# EAGLE schematic stereo_mix_back_digital (EAGLE 9.6.2)

## Sheet 1 of 5: Channels
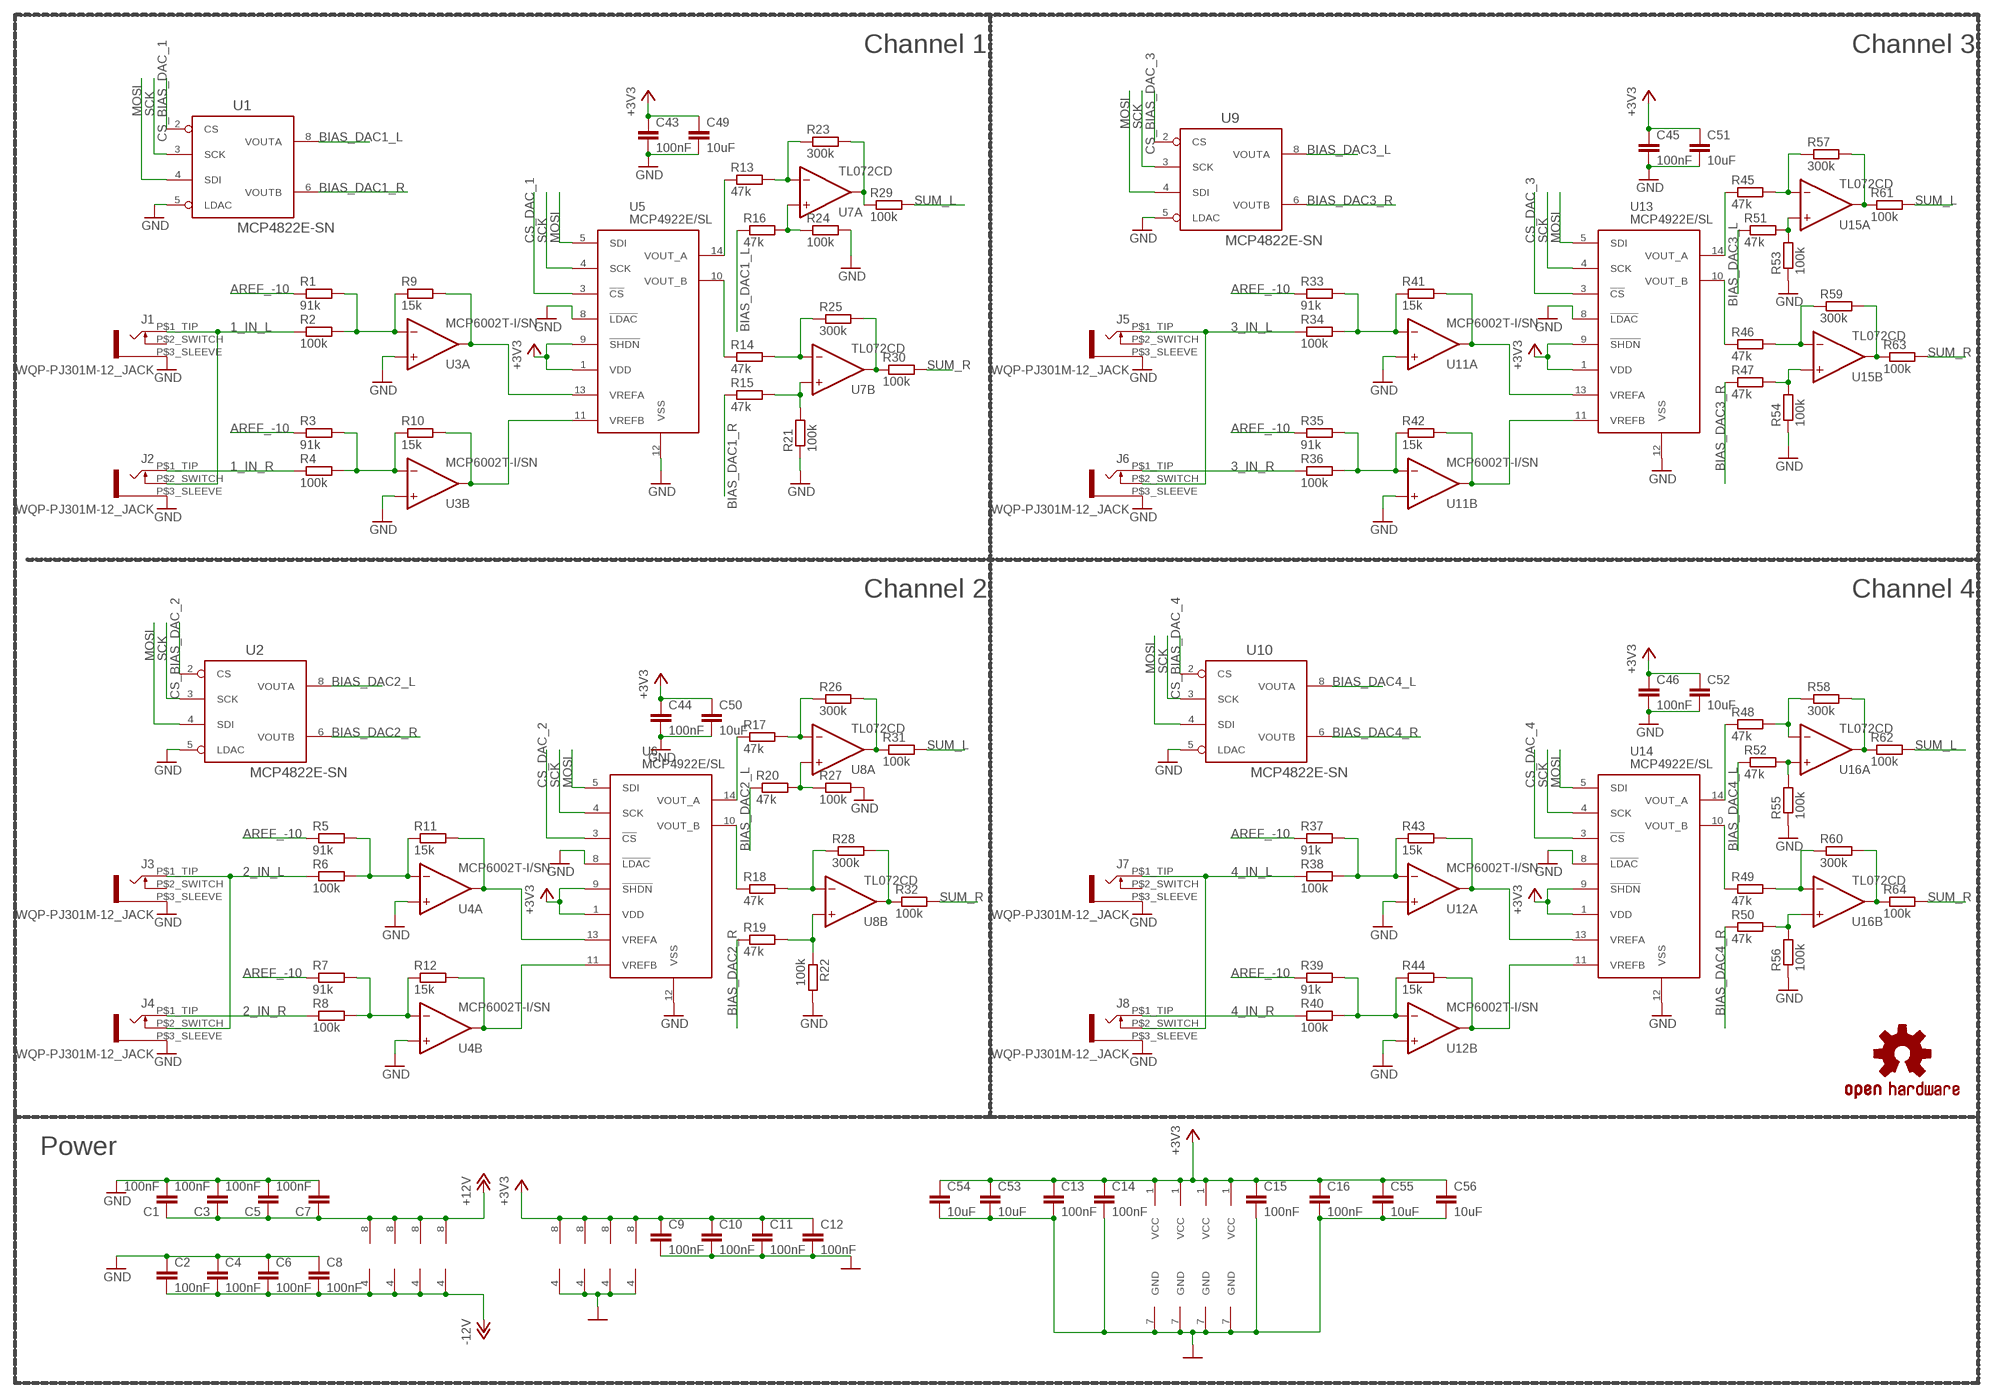
[diagram p0: schematic, sheet 1]

### Parts
C1  100nF  C-EUC0402  [C0402]
C2  100nF  C-EUC0402  [C0402]
C3  100nF  C-EUC0402  [C0402]
C4  100nF  C-EUC0402  [C0402]
C5  100nF  C-EUC0402  [C0402]
C6  100nF  C-EUC0402  [C0402]
C7  100nF  C-EUC0402  [C0402]
C8  100nF  C-EUC0402  [C0402]
C9  100nF  C-EUC0402  [C0402]
C10  100nF  C-EUC0402  [C0402]
C11  100nF  C-EUC0402  [C0402]
C12  100nF  C-EUC0402  [C0402]
C13  100nF  C-EUC0402  [C0402]
C14  100nF  C-EUC0402  [C0402]
C15  100nF  C-EUC0402  [C0402]
C16  100nF  C-EUC0402  [C0402]
C43  100nF  C-EUC0402  [C0402]
C44  100nF  C-EUC0402  [C0402]
C45  100nF  C-EUC0402  [C0402]
C46  100nF  C-EUC0402  [C0402]
C49  10uF  C-EUC0805  [C0805]
C50  10uF  C-EUC0805  [C0805]
C51  10uF  C-EUC0805  [C0805]
C52  10uF  C-EUC0805  [C0805]
C53  10uF  C-EUC0805  [C0805]
C54  10uF  C-EUC0805  [C0805]
C55  10uF  C-EUC0805  [C0805]
C56  10uF  C-EUC0805  [C0805]
J1  WQP-PJ301M-12_JACK  [WQP-PJ301M-12_JACK]
J2  WQP-PJ301M-12_JACK  [WQP-PJ301M-12_JACK]
J3  WQP-PJ301M-12_JACK  [WQP-PJ301M-12_JACK]
J4  WQP-PJ301M-12_JACK  [WQP-PJ301M-12_JACK]
J5  WQP-PJ301M-12_JACK  [WQP-PJ301M-12_JACK]
J6  WQP-PJ301M-12_JACK  [WQP-PJ301M-12_JACK]
J7  WQP-PJ301M-12_JACK  [WQP-PJ301M-12_JACK]
J8  WQP-PJ301M-12_JACK  [WQP-PJ301M-12_JACK]
LOGO1  OSHW-LOGOS  [OSHW-LOGO-S]
R1  91k  R-EU_R0402  [R0402]
R2  100k  R-EU_R0402  [R0402]
R3  91k  R-EU_R0402  [R0402]
R4  100k  R-EU_R0402  [R0402]
R5  91k  R-EU_R0402  [R0402]
R6  100k  R-EU_R0402  [R0402]
R7  91k  R-EU_R0402  [R0402]
R8  100k  R-EU_R0402  [R0402]
R9  15k  R-EU_R0402  [R0402]
R10  15k  R-EU_R0402  [R0402]
R11  15k  R-EU_R0402  [R0402]
R12  15k  R-EU_R0402  [R0402]
R13  47k  R-EU_R0402  [R0402]
R14  47k  R-EU_R0402  [R0402]
R15  47k  R-EU_R0402  [R0402]
R16  47k  R-EU_R0402  [R0402]
R17  47k  R-EU_R0402  [R0402]
R18  47k  R-EU_R0402  [R0402]
R19  47k  R-EU_R0402  [R0402]
R20  47k  R-EU_R0402  [R0402]
R21  100k  R-EU_R0402  [R0402]
R22  100k  R-EU_R0402  [R0402]
R23  300k  R-EU_R0402  [R0402]
R24  100k  R-EU_R0402  [R0402]
R25  300k  R-EU_R0402  [R0402]
R26  300k  R-EU_R0402  [R0402]
R27  100k  R-EU_R0402  [R0402]
R28  300k  R-EU_R0402  [R0402]
R29  100k  R-EU_R0402  [R0402]
R30  100k  R-EU_R0402  [R0402]
R31  100k  R-EU_R0402  [R0402]
R32  100k  R-EU_R0402  [R0402]
R33  91k  R-EU_R0402  [R0402]
R34  100k  R-EU_R0402  [R0402]
R35  91k  R-EU_R0402  [R0402]
R36  100k  R-EU_R0402  [R0402]
R37  91k  R-EU_R0402  [R0402]
R38  100k  R-EU_R0402  [R0402]
R39  91k  R-EU_R0402  [R0402]
R40  100k  R-EU_R0402  [R0402]
R41  15k  R-EU_R0402  [R0402]
R42  15k  R-EU_R0402  [R0402]
R43  15k  R-EU_R0402  [R0402]
R44  15k  R-EU_R0402  [R0402]
R45  47k  R-EU_R0402  [R0402]
R46  47k  R-EU_R0402  [R0402]
R47  47k  R-EU_R0402  [R0402]
R48  47k  R-EU_R0402  [R0402]
R49  47k  R-EU_R0402  [R0402]
R50  47k  R-EU_R0402  [R0402]
R51  47k  R-EU_R0402  [R0402]
R52  47k  R-EU_R0402  [R0402]
R53  100k  R-EU_R0402  [R0402]
R54  100k  R-EU_R0402  [R0402]
R55  100k  R-EU_R0402  [R0402]
R56  100k  R-EU_R0402  [R0402]
R57  300k  R-EU_R0402  [R0402]
R58  300k  R-EU_R0402  [R0402]
R59  300k  R-EU_R0402  [R0402]
R60  300k  R-EU_R0402  [R0402]
R61  100k  R-EU_R0402  [R0402]
R62  100k  R-EU_R0402  [R0402]
R63  100k  R-EU_R0402  [R0402]
R64  100k  R-EU_R0402  [R0402]
U1  MCP4822E-SN  [SOIC8]
U2  MCP4822E-SN  [SOIC8]
U3  MCP6002T-I/SN  [SOIC8]
U4  MCP6002T-I/SN  [SOIC8]
U5  MCP4922E/SL  [SO-14]
U6  MCP4922E/SL  [SO-14]
U7  TL072CD  [SOIC8]
U8  TL072CD  [SOIC8]
U9  MCP4822E-SN  [SOIC8]
U10  MCP4822E-SN  [SOIC8]
U11  MCP6002T-I/SN  [SOIC8]
U12  MCP6002T-I/SN  [SOIC8]
U13  MCP4922E/SL  [SO-14]
U14  MCP4922E/SL  [SO-14]
U15  TL072CD  [SOIC8]
U16  TL072CD  [SOIC8]

### Nets
1_IN_L: J1.P$1_TIP J2.P$2_SWITCH R2.1
1_IN_R: J2.P$1_TIP R4.1
2_IN_L: J3.P$1_TIP J4.P$2_SWITCH R6.1
2_IN_R: J4.P$1_TIP R8.1
3_IN_L: J5.P$1_TIP J6.P$2_SWITCH R34.1
3_IN_R: J6.P$1_TIP R36.1
4_IN_L: J7.P$1_TIP J8.P$2_SWITCH R38.1
4_IN_R: J8.P$1_TIP R40.1
+3V3 [power]: C9.1 C10.1 C11.1 C12.1 C13.1 C14.1 C15.1 C16.1 C43.1 C44.1 C45.1 C46.1 C49.1 C50.1 C51.1 C52.1 C53.1 C54.1 C55.1 C56.1 U1.1(VCC) U2.1(VCC) U3.8(P:V+) U4.8(P:V+) U5.1(VDD) U5.9(!SHDN) U6.1(VDD) U6.9(!SHDN) U9.1(VCC) U10.1(VCC) U11.8(P:V+) U12.8(P:V+) U13.1(VDD) U13.9(!SHDN) U14.1(VDD) U14.9(!SHDN) ; also sheet 2,3,5
+12V [power]: C1.1 C3.1 C5.1 C7.1 U7.8(P:V+) U8.8(P:V+) U15.8(P:V+) U16.8(P:V+) ; also sheet 4,5
-12V [power]: C2.2 C4.2 C6.2 C8.2 U7.4(P:V-) U8.4(P:V-) U15.4(P:V-) U16.4(P:V-) ; also sheet 4,5
AREF_-10 [power]: R1.1 R3.1 R5.1 R7.1 R33.1 R35.1 R37.1 R39.1 ; also sheet 2,5
BIAS_DAC1_L: R16.1 U1.8(VOUTA)
BIAS_DAC1_R: R15.1 U1.6(VOUTB)
BIAS_DAC2_L: R20.1 U2.8(VOUTA)
BIAS_DAC2_R: R19.1 U2.6(VOUTB)
BIAS_DAC3_L: R51.1 U9.8(VOUTA)
BIAS_DAC3_R: R47.1 U9.6(VOUTB)
BIAS_DAC4_L: R52.1 U10.8(VOUTA)
BIAS_DAC4_R: R50.1 U10.6(VOUTB)
CS_BIAS_DAC_1: U1.2(CS) ; also sheet 3
CS_BIAS_DAC_2: U2.2(CS) ; also sheet 3
CS_BIAS_DAC_3: U9.2(CS) ; also sheet 3
CS_BIAS_DAC_4: U10.2(CS) ; also sheet 3
CS_DAC_1: U5.3(!CS) ; also sheet 3
CS_DAC_2: U6.3(!CS) ; also sheet 3
CS_DAC_3: U13.3(!CS) ; also sheet 3
CS_DAC_4: U14.3(!CS) ; also sheet 3
GND: C1.2 C2.1 C3.2 C4.1 C5.2 C6.1 C7.2 C8.1 C9.2 C10.2 C11.2 C12.2 C13.2 C14.2 C15.2 C16.2 C43.2 C44.2 C45.2 C46.2 C49.2 C50.2 C51.2 C52.2 C53.2 C54.2 C55.2 C56.2 J1.P$3_SLEEVE J2.P$3_SLEEVE J3.P$3_SLEEVE J4.P$3_SLEEVE J5.P$3_SLEEVE J6.P$3_SLEEVE J7.P$3_SLEEVE J8.P$3_SLEEVE R21.1 R22.2 R24.2 R27.2 R53.1 R54.1 R55.1 R56.1 U1.5(LDAC) U1.7(GND) U2.5(LDAC) U2.7(GND) U3.3(A:+IN) U3.4(P:V-) U3.5(B:+IN) U4.3(A:+IN) U4.4(P:V-) U4.5(B:+IN) U5.8(!LDAC) U5.12(VSS) U6.8(!LDAC) U6.12(VSS) U9.5(LDAC) U9.7(GND) U10.5(LDAC) U10.7(GND) U11.3(A:+IN) U11.4(P:V-) U11.5(B:+IN) U12.3(A:+IN) U12.4(P:V-) U12.5(B:+IN) U13.8(!LDAC) U13.12(VSS) U14.8(!LDAC) U14.12(VSS) ; also sheet 2,3,4,5
MOSI: U1.4(SDI) U2.4(SDI) U5.5(SDI) U6.5(SDI) U9.4(SDI) U10.4(SDI) U13.5(SDI) U14.5(SDI) ; also sheet 3
N$1: R13.1 U5.14(VOUT_A)
N$2: R3.2 R4.2 R10.1 U3.6(B:-IN)
N$3: R13.2 R23.1 U7.2(A:-IN)
N$4: R9.2 U3.1(A:OUT) U5.13(VREFA)
N$5: R10.2 U3.7(B:OUT) U5.11(VREFB)
N$6: R1.2 R2.2 R9.1 U3.2(A:-IN)
N$7: R25.2 R30.1 U7.7(B:OUT)
N$8: R23.2 R29.1 U7.1(A:OUT)
N$9: R14.2 R25.1 U7.6(B:-IN)
N$10: R14.1 U5.10(VOUT_B)
N$14: R16.2 R24.1 U7.3(A:+IN)
N$16: R15.2 R21.2 U7.5(B:+IN)
N$19: R7.2 R8.2 R12.1 U4.6(B:-IN)
N$20: R12.2 U4.7(B:OUT) U6.11(VREFB)
N$21: R11.2 U4.1(A:OUT) U6.13(VREFA)
N$22: R5.2 R6.2 R11.1 U4.2(A:-IN)
N$23: R17.1 U6.14(VOUT_A)
N$24: R17.2 R26.1 U8.2(A:-IN)
N$25: R26.2 R31.1 U8.1(A:OUT)
N$26: R18.2 R28.1 U8.6(B:-IN)
N$27: R18.1 U6.10(VOUT_B)
N$28: R28.2 R32.1 U8.7(B:OUT)
N$29: R35.2 R36.2 R42.1 U11.6(B:-IN)
N$30: R42.2 U11.7(B:OUT) U13.11(VREFB)
N$31: R41.2 U11.1(A:OUT) U13.13(VREFA)
N$33: R33.2 R34.2 R41.1 U11.2(A:-IN)
N$34: R45.1 U13.14(VOUT_A)
N$35: R45.2 R57.1 U15.2(A:-IN)
N$36: R57.2 R61.1 U15.1(A:OUT)
N$37: R46.2 R59.1 U15.6(B:-IN)
N$38: R46.1 U13.10(VOUT_B)
N$39: R59.2 R63.1 U15.7(B:OUT)
N$40: R39.2 R40.2 R44.1 U12.6(B:-IN)
N$41: R44.2 U12.7(B:OUT) U14.11(VREFB)
N$44: R43.2 U12.1(A:OUT) U14.13(VREFA)
N$46: R37.2 R38.2 R43.1 U12.2(A:-IN)
N$49: R48.1 U14.14(VOUT_A)
N$50: R48.2 R58.1 U16.2(A:-IN)
N$51: R58.2 R62.1 U16.1(A:OUT)
N$52: R49.2 R60.1 U16.6(B:-IN)
N$53: R49.1 U14.10(VOUT_B)
N$54: R60.2 R64.1 U16.7(B:OUT)
N$67: R20.2 R27.1 U8.3(A:+IN)
N$68: R19.2 R22.1 U8.5(B:+IN)
N$70: R51.2 R53.2 U15.3(A:+IN)
N$71: R47.2 R54.2 U15.5(B:+IN)
N$72: R50.2 R56.2 U16.5(B:+IN)
N$73: R52.2 R55.2 U16.3(A:+IN)
SCK: U1.3(SCK) U2.3(SCK) U5.4(SCK) U6.4(SCK) U9.3(SCK) U10.3(SCK) U13.4(SCK) U14.4(SCK) ; also sheet 3
SUM_L: R29.2 R31.2 R61.2 R62.2 ; also sheet 4
SUM_R: R30.2 R32.2 R63.2 R64.2 ; also sheet 4
Unconnected: J1.P$2_SWITCH J3.P$2_SWITCH J5.P$2_SWITCH J7.P$2_SWITCH

### Notes on the sheet
- Channel 1 | Channel 3
- Channel 2 | Channel 4
- Power

## Sheet 2 of 5: CV Inputs
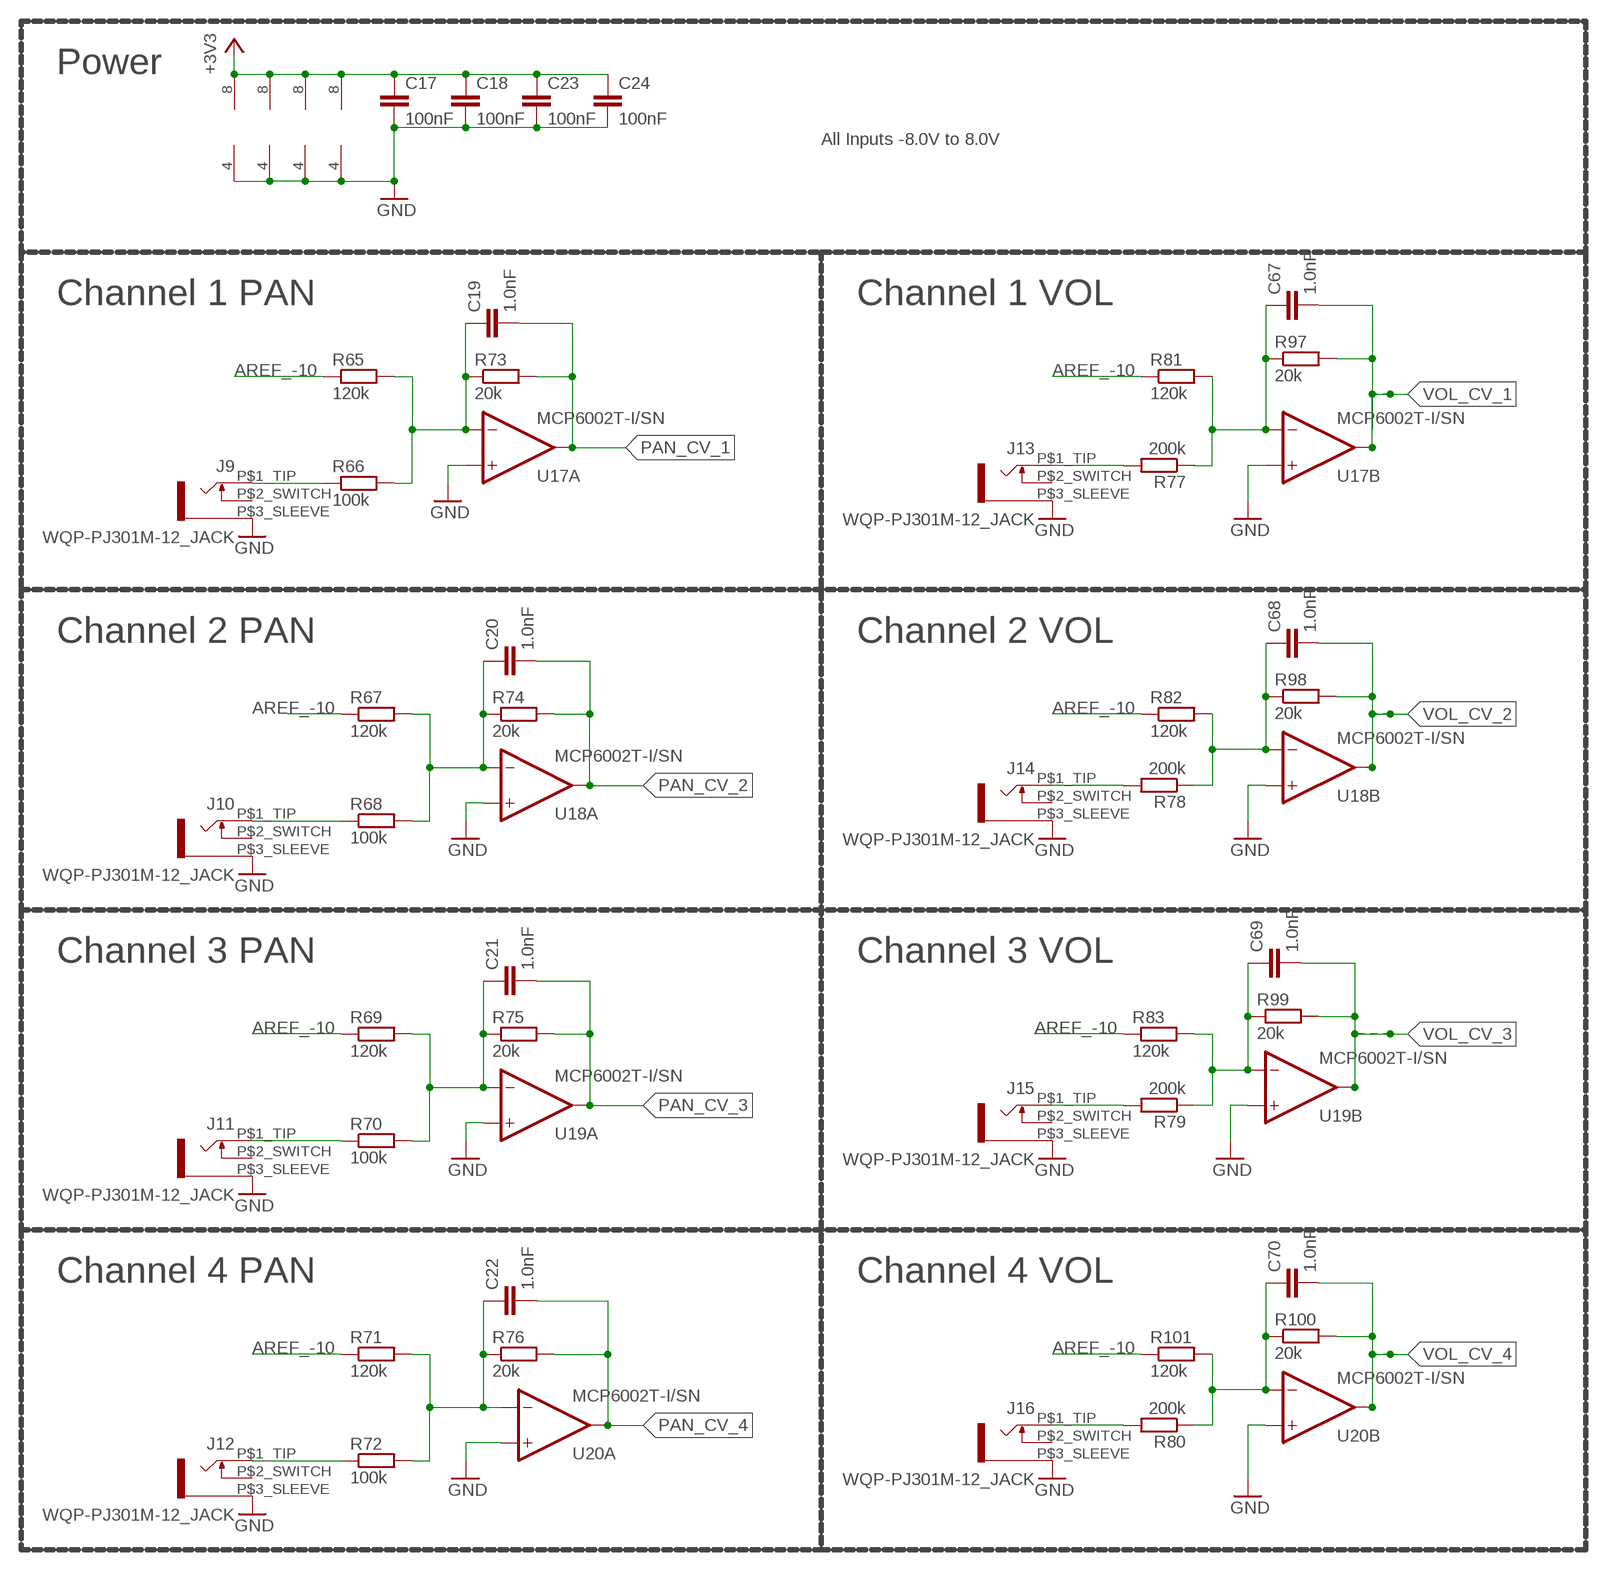
[diagram p1: schematic, sheet 2]

### Parts
C17  100nF  C-EUC0402  [C0402]
C18  100nF  C-EUC0402  [C0402]
C19  1.0nF  C-EUC0402  [C0402]
C20  1.0nF  C-EUC0402  [C0402]
C21  1.0nF  C-EUC0402  [C0402]
C22  1.0nF  C-EUC0402  [C0402]
C23  100nF  C-EUC0402  [C0402]
C24  100nF  C-EUC0402  [C0402]
C67  1.0nF  C-EUC0402  [C0402]
C68  1.0nF  C-EUC0402  [C0402]
C69  1.0nF  C-EUC0402  [C0402]
C70  1.0nF  C-EUC0402  [C0402]
J9  WQP-PJ301M-12_JACK  [WQP-PJ301M-12_JACK]
J10  WQP-PJ301M-12_JACK  [WQP-PJ301M-12_JACK]
J11  WQP-PJ301M-12_JACK  [WQP-PJ301M-12_JACK]
J12  WQP-PJ301M-12_JACK  [WQP-PJ301M-12_JACK]
J13  WQP-PJ301M-12_JACK  [WQP-PJ301M-12_JACK]
J14  WQP-PJ301M-12_JACK  [WQP-PJ301M-12_JACK]
J15  WQP-PJ301M-12_JACK  [WQP-PJ301M-12_JACK]
J16  WQP-PJ301M-12_JACK  [WQP-PJ301M-12_JACK]
R65  120k  R-EU_R0402  [R0402]
R66  100k  R-EU_R0402  [R0402]
R67  120k  R-EU_R0402  [R0402]
R68  100k  R-EU_R0402  [R0402]
R69  120k  R-EU_R0402  [R0402]
R70  100k  R-EU_R0402  [R0402]
R71  120k  R-EU_R0402  [R0402]
R72  100k  R-EU_R0402  [R0402]
R73  20k  R-EU_R0402  [R0402]
R74  20k  R-EU_R0402  [R0402]
R75  20k  R-EU_R0402  [R0402]
R76  20k  R-EU_R0402  [R0402]
R77  200k  R-EU_R0402  [R0402]
R78  200k  R-EU_R0402  [R0402]
R79  200k  R-EU_R0402  [R0402]
R80  200k  R-EU_R0402  [R0402]
R81  120k  R-EU_R0402  [R0402]
R82  120k  R-EU_R0402  [R0402]
R83  120k  R-EU_R0402  [R0402]
R97  20k  R-EU_R0402  [R0402]
R98  20k  R-EU_R0402  [R0402]
R99  20k  R-EU_R0402  [R0402]
R100  20k  R-EU_R0402  [R0402]
R101  120k  R-EU_R0402  [R0402]
U17  MCP6002T-I/SN  [SOIC8]
U18  MCP6002T-I/SN  [SOIC8]
U19  MCP6002T-I/SN  [SOIC8]
U20  MCP6002T-I/SN  [SOIC8]

### Nets
2_PAN_CV_IN: J10.P$1_TIP R68.1
2_VOLUME_CV: J14.P$1_TIP R78.2
3_PAN_CV_IN: J11.P$1_TIP R70.1
3_VOLUME_CV: J15.P$1_TIP R79.2
4_PAN_CV_IN: J12.P$1_TIP R72.1
4_VOLUME_CV: J16.P$1_TIP R80.2
+3V3 [power]: C17.1 C18.1 C23.1 C24.1 U17.8(P:V+) U18.8(P:V+) U19.8(P:V+) U20.8(P:V+) ; also sheet 1,3,5
AREF_-10 [power]: R65.1 R67.1 R69.1 R71.1 R81.1 R82.1 R83.1 R101.1 ; also sheet 1,5
GND: C17.2 C18.2 C23.2 C24.2 J9.P$3_SLEEVE J10.P$3_SLEEVE J11.P$3_SLEEVE J12.P$3_SLEEVE J13.P$3_SLEEVE J14.P$3_SLEEVE J15.P$3_SLEEVE J16.P$3_SLEEVE U17.3(A:+IN) U17.4(P:V-) U17.5(B:+IN) U18.3(A:+IN) U18.4(P:V-) U18.5(B:+IN) U19.3(A:+IN) U19.4(P:V-) U19.5(B:+IN) U20.3(A:+IN) U20.4(P:V-) U20.5(B:+IN) ; also sheet 1,3,4,5
N$15: C69.1 R79.1 R83.2 R99.1 U19.6(B:-IN)
N$17: C70.1 R80.1 R100.1 R101.2 U20.6(B:-IN)
N$32: C19.1 R65.2 R66.2 R73.1 U17.2(A:-IN)
N$62: C22.1 R71.2 R72.2 R76.1 U20.2(A:-IN)
N$63: C21.1 R69.2 R70.2 R75.1 U19.2(A:-IN)
N$64: C20.1 R67.2 R68.2 R74.1 U18.2(A:-IN)
N$65: C67.1 R77.1 R81.2 R97.1 U17.6(B:-IN)
N$74: C68.1 R78.1 R82.2 R98.1 U18.6(B:-IN)
N$84: J9.P$1_TIP R66.1
N$89: J13.P$1_TIP R77.2
PAN_CV_1: C19.2 R73.2 U17.1(A:OUT) ; also sheet 3
PAN_CV_2: C20.2 R74.2 U18.1(A:OUT) ; also sheet 3
PAN_CV_3: C21.2 R75.2 U19.1(A:OUT) ; also sheet 3
PAN_CV_4: C22.2 R76.2 U20.1(A:OUT) ; also sheet 3
VOL_CV_1: C67.2 R97.2 U17.7(B:OUT) ; also sheet 3
VOL_CV_2: C68.2 R98.2 U18.7(B:OUT) ; also sheet 3
VOL_CV_3: C69.2 R99.2 U19.7(B:OUT) ; also sheet 3
VOL_CV_4: C70.2 R100.2 U20.7(B:OUT) ; also sheet 3
Unconnected: J9.P$2_SWITCH J10.P$2_SWITCH J11.P$2_SWITCH J12.P$2_SWITCH J13.P$2_SWITCH J14.P$2_SWITCH J15.P$2_SWITCH J16.P$2_SWITCH

### Notes on the sheet
- Power
- All Inputs -8.0V to 8.0V
- Channel 1 PAN | Channel 1 VOL
- Channel 2 PAN | Channel 2 VOL
- Channel 3 PAN | Channel 3 VOL
- Channel 4 PAN | Channel 4 VOL

## Sheet 3 of 5: MCU
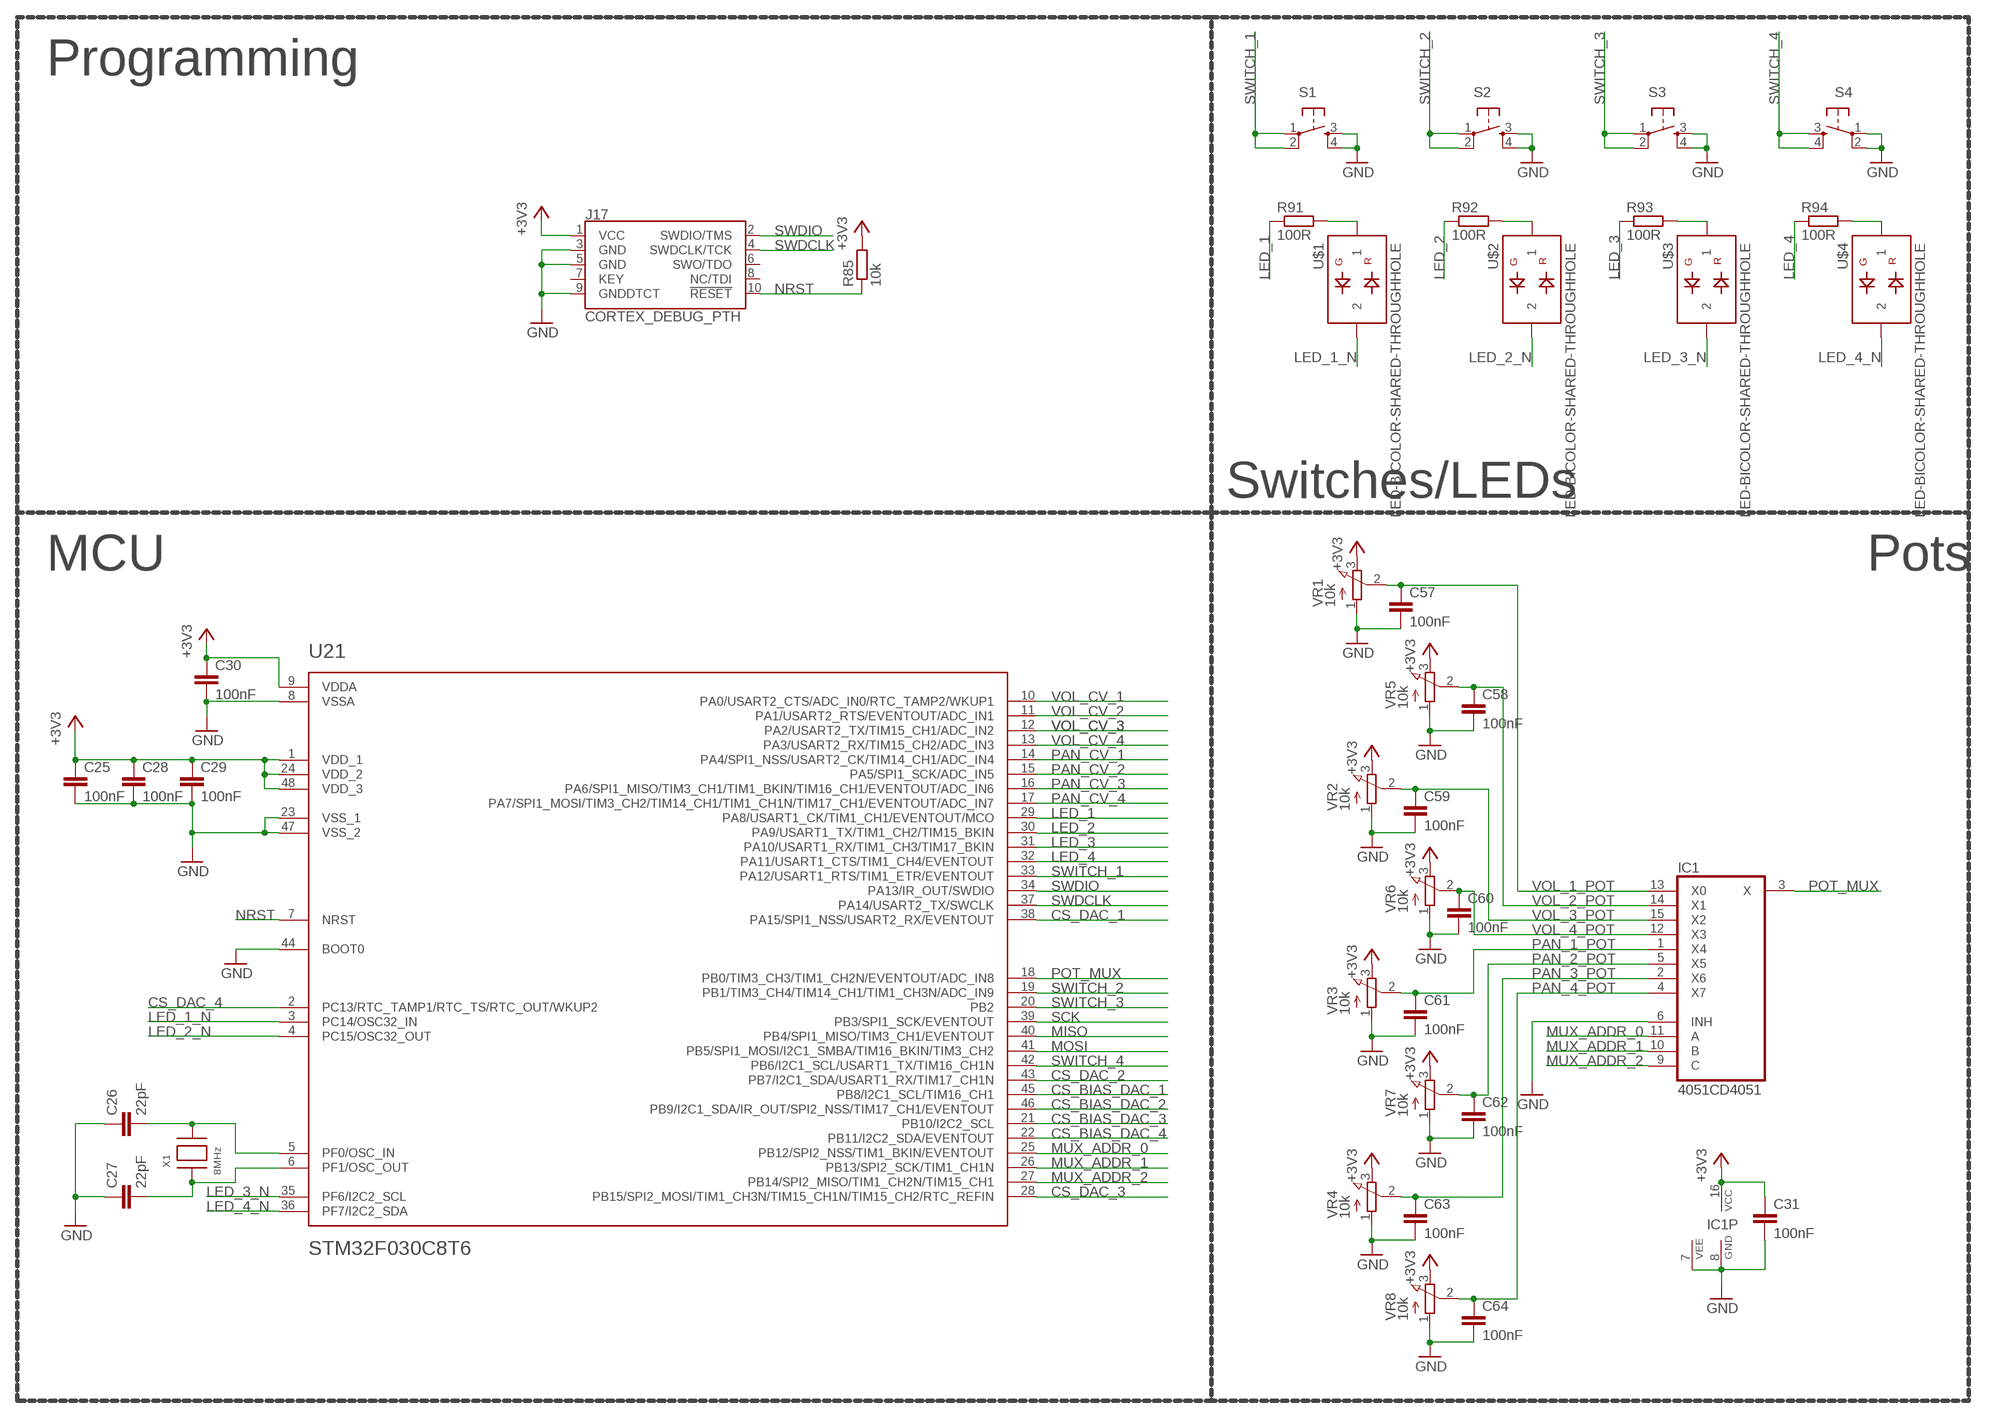
[diagram p2: schematic, sheet 3]

### Parts
C25  100nF  C-EUC0402  [C0402]
C26  22pF  C-EUC0402  [C0402]
C27  22pF  C-EUC0402  [C0402]
C28  100nF  C-EUC0402  [C0402]
C29  100nF  C-EUC0402  [C0402]
C30  100nF  C-EUC0402  [C0402]
C31  100nF  C-EUC0402  [C0402]
C57  100nF  C-EUC0402  [C0402]
C58  100nF  C-EUC0402  [C0402]
C59  100nF  C-EUC0402  [C0402]
C60  100nF  C-EUC0402  [C0402]
C61  100nF  C-EUC0402  [C0402]
C62  100nF  C-EUC0402  [C0402]
C63  100nF  C-EUC0402  [C0402]
C64  100nF  C-EUC0402  [C0402]
IC1  4051CD4051  [SOIC16N]
J17  CORTEX_DEBUG_PTH  [2X5-PTH-1.27MM]
R85  10k  R-EU_R0402  [R0402]
R91  100R  R-EU_R0402  [R0402]
R92  100R  R-EU_R0402  [R0402]
R93  100R  R-EU_R0402  [R0402]
R94  100R  R-EU_R0402  [R0402]
S1  TAC_SWITCHPTH  [TACTILE-PTH]
S2  TAC_SWITCHPTH  [TACTILE-PTH]
S3  TAC_SWITCHPTH  [TACTILE-PTH]
S4  TAC_SWITCHPTH  [TACTILE-PTH]
U21  STM32F030C8T6  [LQFP48]
U$1  LED-BICOLOR-SHARED-THROUGHHOLE  [LED3MM]
U$2  LED-BICOLOR-SHARED-THROUGHHOLE  [LED3MM]
U$3  LED-BICOLOR-SHARED-THROUGHHOLE  [LED3MM]
U$4  LED-BICOLOR-SHARED-THROUGHHOLE  [LED3MM]
VR1  10k  9MM_SNAP-IN_POT_  [9MM_SNAP-IN_POT]
VR2  10k  9MM_SNAP-IN_POT_  [9MM_SNAP-IN_POT]
VR3  10k  9MM_SNAP-IN_POT_  [9MM_SNAP-IN_POT]
VR4  10k  9MM_SNAP-IN_POT_  [9MM_SNAP-IN_POT]
VR5  10k  9MM_SNAP-IN_POT_  [9MM_SNAP-IN_POT]
VR6  10k  9MM_SNAP-IN_POT_  [9MM_SNAP-IN_POT]
VR7  10k  9MM_SNAP-IN_POT_  [9MM_SNAP-IN_POT]
VR8  10k  9MM_SNAP-IN_POT_  [9MM_SNAP-IN_POT]
X1  8MHz  XTALNX5032  [NX5032]

### Nets
+3V3 [power]: C25.1 C28.1 C29.1 C30.1 C31.1 IC1.16(VCC) J17.1(VCC) R85.2 U21.1(VDD_1) U21.9(VDDA) U21.24(VDD_2) U21.48(VDD_3) VR1.3(E) VR2.3(E) VR3.3(E) VR4.3(E) VR5.3(E) VR6.3(E) VR7.3(E) VR8.3(E) ; also sheet 1,2,5
CS_BIAS_DAC_1: U21.45(PB8/I2C1_SCL/TIM16_CH1) ; also sheet 1
CS_BIAS_DAC_2: U21.46(PB9/I2C1_SDA/IR_OUT/SPI2_NSS/TIM17_CH1/EVENTOUT) ; also sheet 1
CS_BIAS_DAC_3: U21.21(PB10/I2C2_SCL) ; also sheet 1
CS_BIAS_DAC_4: U21.22(PB11/I2C2_SDA/EVENTOUT) ; also sheet 1
CS_DAC_1: U21.38(PA15/SPI1_NSS/USART2_RX/EVENTOUT) ; also sheet 1
CS_DAC_2: U21.43(PB7/I2C1_SDA/USART1_RX/TIM17_CH1N) ; also sheet 1
CS_DAC_3: U21.28(PB15/SPI2_MOSI/TIM1_CH3N/TIM15_CH1N/TIM15_CH2/RTC_REFIN) ; also sheet 1
CS_DAC_4: U21.2(PC13/RTC_TAMP1/RTC_TS/RTC_OUT/WKUP2) ; also sheet 1
GND: C25.2 C26.1 C27.1 C28.2 C29.2 C30.2 C31.2 C57.2 C58.2 C59.2 C60.2 C61.2 C62.2 C63.2 C64.2 IC1.6(INH) IC1.7(VEE) IC1.8(GND) J17.3(GND) J17.5(GND) J17.9(GNDDTCT) S1.3 S1.4 S2.3 S2.4 S3.3 S3.4 S4.1 S4.2 U21.8(VSSA) U21.23(VSS_1) U21.44(BOOT0) U21.47(VSS_2) VR1.1(A) VR2.1(A) VR3.1(A) VR4.1(A) VR5.1(A) VR6.1(A) VR7.1(A) VR8.1(A) ; also sheet 1,2,4,5
LED_1: R91.1 U21.29(PA8/USART1_CK/TIM1_CH1/EVENTOUT/MCO)
LED_1_N: U21.3(PC14/OSC32_IN) U$1.2
LED_2: R92.1 U21.30(PA9/USART1_TX/TIM1_CH2/TIM15_BKIN)
LED_2_N: U21.4(PC15/OSC32_OUT) U$2.2
LED_3: R93.1 U21.31(PA10/USART1_RX/TIM1_CH3/TIM17_BKIN)
LED_3_N: U21.35(PF6/I2C2_SCL) U$3.2
LED_4: R94.1 U21.32(PA11/USART1_CTS/TIM1_CH4/EVENTOUT)
LED_4_N: U21.36(PF7/I2C2_SDA) U$4.2
MISO: U21.40(PB4/SPI1_MISO/TIM3_CH1/EVENTOUT)
MOSI: U21.41(PB5/SPI1_MOSI/I2C1_SMBA/TIM16_BKIN/TIM3_CH2) ; also sheet 1
MUX_ADDR_0: IC1.11(A) U21.25(PB12/SPI2_NSS/TIM1_BKIN/EVENTOUT)
MUX_ADDR_1: IC1.10(B) U21.26(PB13/SPI2_SCK/TIM1_CH1N)
MUX_ADDR_2: IC1.9(C) U21.27(PB14/SPI2_MISO/TIM1_CH2N/TIM15_CH1)
N$12: R91.2 U$1.1
N$13: R92.2 U$2.1
N$18: R93.2 U$3.1
N$42: R94.2 U$4.1
N$75: C27.2 U21.6(PF1/OSC_OUT) X1.P$1
N$76: C26.2 U21.5(PF0/OSC_IN) X1.P$2
NRST: J17.10(!RESET) R85.1 U21.7(NRST)
PAN_1_POT: C61.1 IC1.1(X4) VR3.2(S)
PAN_2_POT: C62.1 IC1.5(X5) VR7.2(S)
PAN_3_POT: C63.1 IC1.2(X6) VR4.2(S)
PAN_4_POT: C64.1 IC1.4(X7) VR8.2(S)
PAN_CV_1: U21.14(PA4/SPI1_NSS/USART2_CK/TIM14_CH1/ADC_IN4) ; also sheet 2
PAN_CV_2: U21.15(PA5/SPI1_SCK/ADC_IN5) ; also sheet 2
PAN_CV_3: U21.16(PA6/SPI1_MISO/TIM3_CH1/TIM1_BKIN/TIM16_CH1/EVENTOUT/ADC_IN6) ; also sheet 2
PAN_CV_4: U21.17(PA7/SPI1_MOSI/TIM3_CH2/TIM14_CH1/TIM1_CH1N/TIM17_CH1/EVENTOUT/ADC_IN7) ; also sheet 2
POT_MUX: IC1.3(X) U21.18(PB0/TIM3_CH3/TIM1_CH2N/EVENTOUT/ADC_IN8)
SCK: U21.39(PB3/SPI1_SCK/EVENTOUT) ; also sheet 1
SWDCLK: J17.4(SWDCLK/TCK) U21.37(PA14/USART2_TX/SWCLK)
SWDIO: J17.2(SWDIO/TMS) U21.34(PA13/IR_OUT/SWDIO)
SWITCH_1: S1.1 S1.2 U21.33(PA12/USART1_RTS/TIM1_ETR/EVENTOUT)
SWITCH_2: S2.1 S2.2 U21.19(PB1/TIM3_CH4/TIM14_CH1/TIM1_CH3N/ADC_IN9)
SWITCH_3: S3.1 S3.2 U21.20(PB2)
SWITCH_4: S4.3 S4.4 U21.42(PB6/I2C1_SCL/USART1_TX/TIM16_CH1N)
VOL_1_POT: C57.1 IC1.13(X0) VR1.2(S)
VOL_2_POT: C58.1 IC1.14(X1) VR5.2(S)
VOL_3_POT: C59.1 IC1.15(X2) VR2.2(S)
VOL_4_POT: C60.1 IC1.12(X3) VR6.2(S)
VOL_CV_1: U21.10(PA0/USART2_CTS/ADC_IN0/RTC_TAMP2/WKUP1) ; also sheet 2
VOL_CV_2: U21.11(PA1/USART2_RTS/EVENTOUT/ADC_IN1) ; also sheet 2
VOL_CV_3: U21.12(PA2/USART2_TX/TIM15_CH1/ADC_IN2) ; also sheet 2
VOL_CV_4: U21.13(PA3/USART2_RX/TIM15_CH2/ADC_IN3) ; also sheet 2
Unconnected: J17.6(SWO/TDO) J17.7(KEY) J17.8(NC/TDI)

### Notes on the sheet
- Programming
- Switches/LEDs
- MCU | Pots

## Sheet 4 of 5: Output
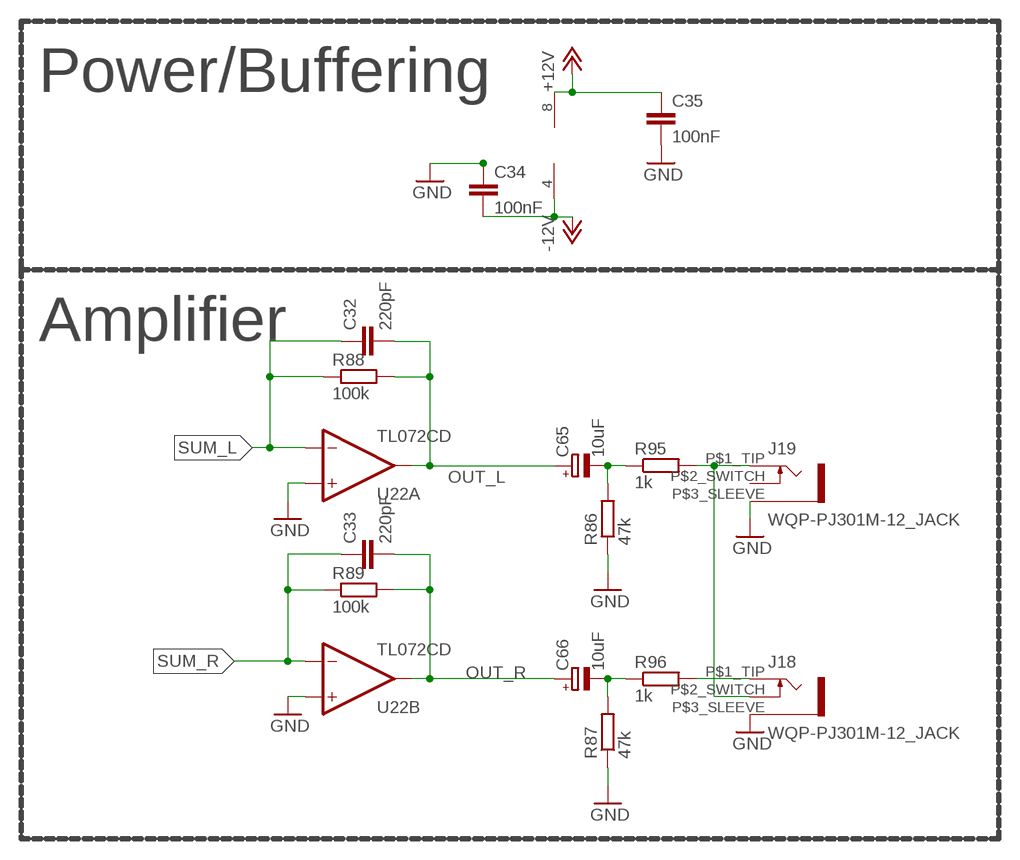
[diagram p3: schematic, sheet 4]

### Parts
C32  220pF  C-EUC0402  [C0402]
C33  220pF  C-EUC0402  [C0402]
C34  100nF  C-EUC0402  [C0402]
C35  100nF  C-EUC0402  [C0402]
C65  10uF  CPOL-EUA/3216-18R  [CASE-A_3216]
C66  10uF  CPOL-EUA/3216-18R  [CASE-A_3216]
J18  WQP-PJ301M-12_JACK  [WQP-PJ301M-12_JACK]
J19  WQP-PJ301M-12_JACK  [WQP-PJ301M-12_JACK]
R86  47k  R-EU_R0402  [R0402]
R87  47k  R-EU_R0402  [R0402]
R88  100k  R-EU_R0402  [R0402]
R89  100k  R-EU_R0402  [R0402]
R95  1k  R-EU_R0402  [R0402]
R96  1k  R-EU_R0402  [R0402]
U22  TL072CD  [SOIC8]

### Nets
+12V [power]: C35.1 U22.8(P:V+) ; also sheet 1,5
-12V [power]: C34.2 U22.4(P:V-) ; also sheet 1,5
GND: C34.1 C35.2 J18.P$3_SLEEVE J19.P$3_SLEEVE R86.1 R87.1 U22.3(A:+IN) U22.5(B:+IN) ; also sheet 1,2,3,5
N$43: J18.P$2_SWITCH J19.P$1_TIP R95.2
N$45: C65.- R86.2 R95.1
N$56: J18.P$1_TIP R96.2
N$57: C66.- R87.2 R96.1
OUT_L: C32.2 C65.+ R88.2 U22.1(A:OUT)
OUT_R: C33.2 C66.+ R89.2 U22.7(B:OUT)
SUM_L: C32.1 R88.1 U22.2(A:-IN) ; also sheet 1
SUM_R: C33.1 R89.1 U22.6(B:-IN) ; also sheet 1
Unconnected: J19.P$2_SWITCH

### Notes on the sheet
- Power/Buffering
- Amplifier

## Sheet 5 of 5: Power
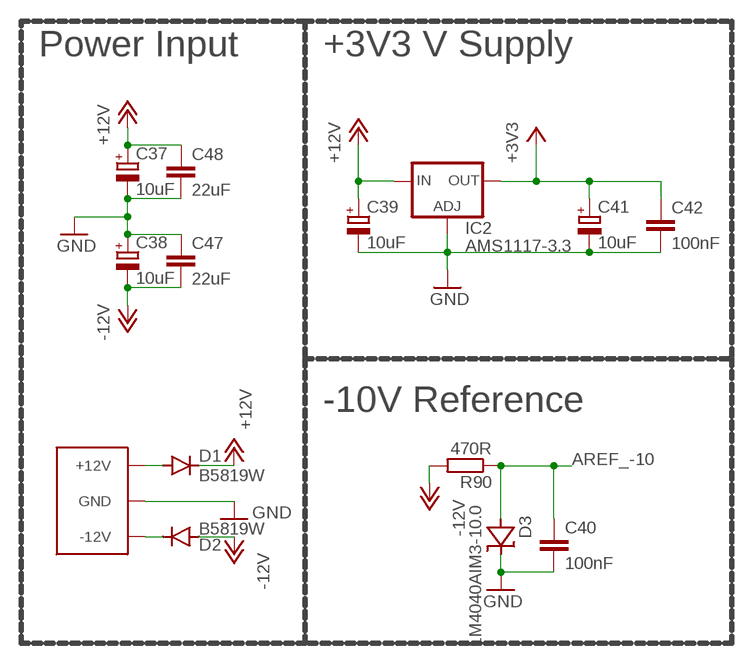
[diagram p4: schematic, sheet 5]

### Parts
C36  EURO_POWER_LOCKFAT-LOCK  [EURO_PWR_HEADER_LOCK]
C37  10uF  CPOL-EUA/3216-18R  [CASE-A_3216]
C38  10uF  CPOL-EUA/3216-18R  [CASE-A_3216]
C39  10uF  CPOL-EUA/3216-18R  [CASE-A_3216]
C40  100nF  C-EUC0402  [C0402]
C41  10uF  CPOL-EUA/3216-18R  [CASE-A_3216]
C42  100nF  C-EUC0402  [C0402]
C47  22uF  C-EUC0805  [C0805]
C48  22uF  C-EUC0805  [C0805]
D1  B5819W  DIODE-SOD123  [SOD123]
D2  B5819W  DIODE-SOD123  [SOD123]
D3  LM4040AIM3-10.0  [SOT23]
IC2  AMS1117-3.3  [SOT223]
R90  470R  R-EU_R0402  [R0402]

### Nets
+3V3 [power]: C41.+ C42.1 IC2.4(OUT) ; also sheet 1,2,3
+12V [power]: C37.+ C39.+ C48.1 D1.C IC2.3(IN) ; also sheet 1,4
-12V [power]: C38.- C47.2 D2.A R90.2 ; also sheet 1,4
AREF_-10 [power]: C40.1 D3.2(A) R90.1 ; also sheet 1,2
GND: C36.GND1(GND) C36.GND2(GND) C36.GND3(GND) C36.GND4(GND) C36.GND5(GND) C36.GND6(GND) C37.- C38.+ C39.- C40.2 C41.- C42.2 C47.1 C48.2 D3.1(C) IC2.1(ADJ) ; also sheet 1,2,3,4
N$47 [power]: C36.POS1(+12V) C36.POS2(+12V) D1.A
N$48 [power]: C36.NEG1(-12V) C36.NEG2(-12V) D2.C

### Notes on the sheet
- Power Input | +3V3 V Supply
- -10V Reference

## Library data of the parts
C1-C35 C40 C42-C44 C47-C64 C67-C70 = jhbruhn-cdr:C-EU: CAPACITOR, European symbol; SPICEPREFIX: C
C36 = MusicThingModular:EURO_POWER_LOCK
C37-C39 C41 C65 C66 = jhbruhn-cdr:CPOL-EU: POLARIZED CAPACITOR, European symbol; SPICEPREFIX: C
C45 C46 = jhbruhn-cr:C-EU: CAPACITOR, European symbol; SPICEPREFIX: C
D1 D2 = jhbruhn-cdr:DIODE-: DIODE
D3 = jhbruhn-ref:LM4040*: LM4040 Zener Voltage Reference
IC1 = jhbruhn-ic:4051: 8-channel ANALOG MULTIPLEXER
IC2 = jhbruhn-ic:AMS1117-*: Low drop fixed and adjustable positive voltage regulators 1 A Source: http://www.st.com/stonline/products/literature/ds/7194/ld1117axx.pdf
J1-J16 J18 J19 = jhbruhn-physical:WQP-PJ301M-12_JACK
J17 = jhbruhn-physical:CORTEX_DEBUG: Cortex Debug Connector - 10 pin Supports JTAG debug, Serial Wire debug, and Serial Wire Viewer. PTH and SMD connector options available. General Connector Information <http://infocenter.arm.com/help/topic/com.arm.doc.faqs/attached/13634/cortex_debug_connectors.pdf> Products: PTH Connector <http://www.digikey.com/product-detail/en/cnc-tech/3220-10-0100-00/1175-1627-ND/3883661> -via Digi-Key SparkFun PSoc <https://www.sparkfun.com/products/13229> SparkFun T <https://www.sparkfun.com/products/13810>
LOGO1 = SparkFun-Aesthetics:OSHW-LOGO: Open-Source Hardware (OSHW) Logo This logo indicates the piece of hardware it is found on incorporates a OSHW license and/or adheres to the definition of open source hardware found here: http://freedomdefined.org/OSHW
R1-R83 R85 R88-R90 R97-R101 = jhbruhn-cr:R-EU_: RESISTOR, European symbol; SPICEPREFIX: R
R86 R87 R91-R96 = jhbruhn-cdr:R-EU_: RESISTOR, European symbol; SPICEPREFIX: R
S1-S4 = jhbruhn-physical:TAC_SWITCH: Momentary Switch Button commonly used for reset or general input. Spark Fun Electronics SKU : COM-00097
U1 U2 U9 U10 = jhbruhn-dac:MCP48*2: MCP48X2 - dual channel, 8/10/12bit DAC, SPI interface, internal reference
U3 U4 U11 U12 U17-U20 = jhbruhn-opamp:MCP6002: Generic Dual Op Amp
U5 U6 U13 U14 = jhbruhn-dac:MCP49*2: MCP49X2 - dual channel, 8/10/12bit DAC, SPI interface, external reference Datasheet: http://ww1.microchip.com/downloads/en/DeviceDoc/22250A.pdf
U7 U8 U15 U16 U22 = jhbruhn-opamp:TL072: Generic Dual Op Amp
U21 = jhbruhn-mcu:STM32F030C8T6
U$1-U$4 = jhbruhn-physical:LED-BICOLOR-SHARED-THROUGHHOLE
VR1-VR8 = jhbruhn-physical:9MM_SNAP-IN_POT: 9mm vertical snap-in pot, Alpha / Panasonic style
X1 = jhbruhn-cdr:XTAL: Low cost SMT crystals, no capacitors included http://www.ladyada.net/library/eagle

## Net classes
0 default: width 0.152 mm
1 power: width 0.254 mm